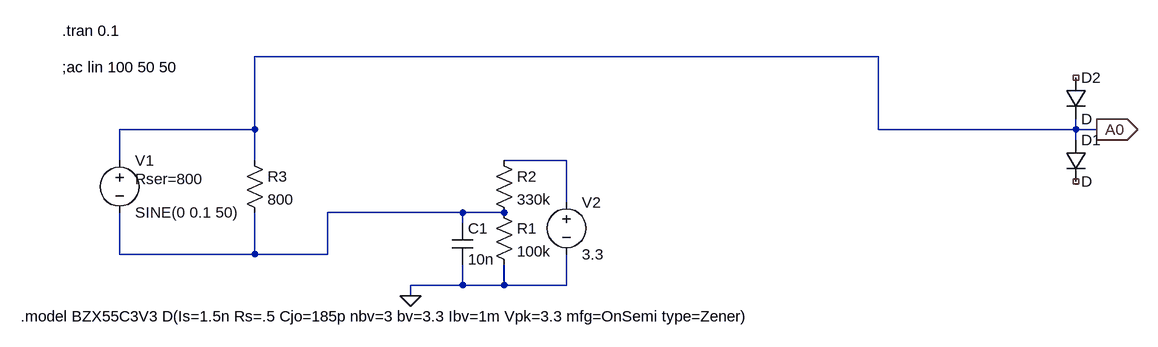
[diagram p0: schematic TA12 - 3.asc]
TA12 - 3.asc, the LTspice schematic file:
Version 4
SHEET 1 1372 680
WIRE 944 -544 -16 -544
WIRE -16 -432 -16 -544
WIRE -16 -432 -224 -432
WIRE 944 -432 944 -544
WIRE 1248 -432 1248 -448
WIRE 1248 -432 944 -432
WIRE 1280 -432 1248 -432
WIRE 1248 -416 1248 -432
WIRE -224 -384 -224 -432
WIRE -16 -384 -16 -432
WIRE 464 -384 368 -384
WIRE 464 -320 464 -384
WIRE 304 -304 96 -304
WIRE 368 -304 304 -304
WIRE 304 -288 304 -304
WIRE -224 -240 -224 -304
WIRE -16 -240 -16 -304
WIRE -16 -240 -224 -240
WIRE 96 -240 96 -304
WIRE 96 -240 -16 -240
WIRE 304 -192 304 -224
WIRE 304 -192 224 -192
WIRE 368 -192 368 -224
WIRE 368 -192 304 -192
WIRE 464 -192 464 -240
WIRE 464 -192 368 -192
WIRE 224 -176 224 -192
FLAG 224 -176 0
FLAG 1280 -432 A0
IOPIN 1280 -432 Out
SYMBOL voltage -224 -400 R0
WINDOW 123 0 0 Left 0
WINDOW 39 24 44 Left 2
SYMATTR SpiceLine Rser=800
SYMATTR InstName V1
SYMATTR Value SINE(0 0.1 50)
SYMBOL diode 1232 -416 R0
SYMATTR InstName D1
SYMBOL diode 1232 -512 R0
SYMATTR InstName D2
SYMBOL res 352 -320 R0
SYMATTR InstName R1
SYMATTR Value 100k
SYMBOL cap 288 -288 R0
SYMATTR InstName C1
SYMATTR Value 10n
SYMBOL res 352 -400 R0
SYMATTR InstName R2
SYMATTR Value 330k
SYMBOL voltage 464 -336 R0
WINDOW 123 0 0 Left 0
WINDOW 39 0 0 Left 0
SYMATTR InstName V2
SYMATTR Value 3.3
SYMBOL res -32 -400 R0
SYMATTR InstName R3
SYMATTR Value 800
TEXT -376 -144 Left 2 !.model BZX55C3V3 D(Is=1.5n Rs=.5 Cjo=185p nbv=3 bv=3.3 Ibv=1m Vpk=3.3 mfg=OnSemi type=Zener)
TEXT -312 -528 Left 2 !;ac lin 100 50 50
TEXT -312 -584 Left 2 !.tran 0.1

The netlist it stands for:
* TA12 - 3.asc
V1 A0 N002 SINE(0 0.1 50) Rser=800
D1 A0 NC_01 D
D2 NC_02 A0 D
R1 N002 0 100k
C1 N002 0 10n
R2 N001 N002 330k
V2 N001 0 3.3
R3 A0 N002 800
.model D D
.lib standard.dio
.model BZX55C3V3 D(Is=1.5n Rs=.5 Cjo=185p nbv=3 bv=3.3 Ibv=1m Vpk=3.3 mfg=OnSemi type=Zener)
;ac lin 100 50 50
.tran 0.1
.backanno
.end